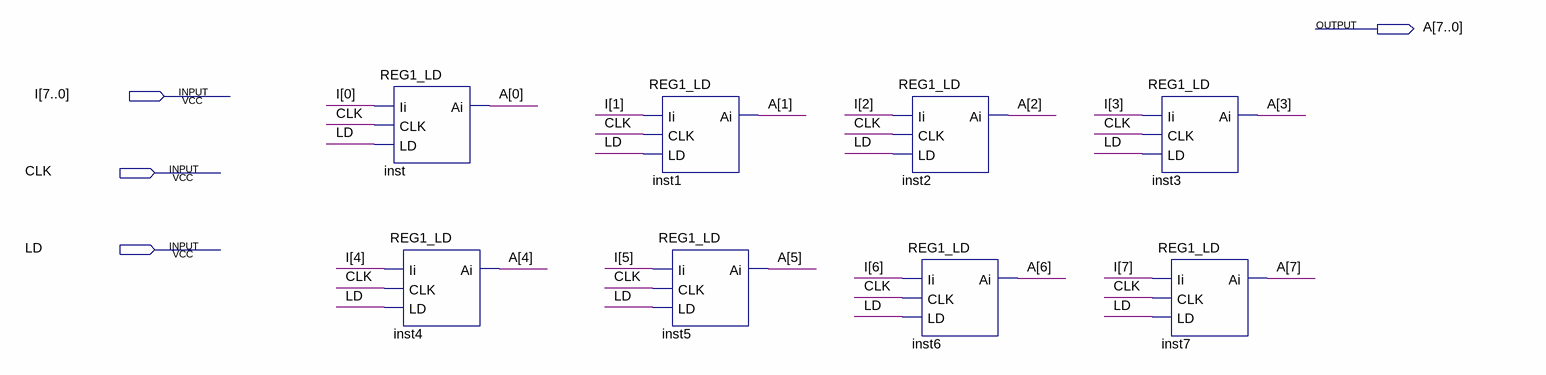
[diagram p0: schematic sheet]
// Quartus schematic REG8_LD.bdf as structural Verilog: 8 symbols, 4 pins
module REG8_LD (
  input  [7:0] I,
  input  CLK,
  input  LD,
  output [7:0] A
);

  REG1_LD inst (.Ii(I[0]), .CLK(CLK), .LD(LD), .Ai(A[0]));
  REG1_LD inst4 (.Ii(I[4]), .CLK(CLK), .LD(LD), .Ai(A[4]));
  REG1_LD inst1 (.Ii(I[1]), .CLK(CLK), .LD(LD), .Ai(A[1]));
  REG1_LD inst5 (.Ii(I[5]), .CLK(CLK), .LD(LD), .Ai(A[5]));
  REG1_LD inst2 (.Ii(I[2]), .CLK(CLK), .LD(LD), .Ai(A[2]));
  REG1_LD inst6 (.Ii(I[6]), .CLK(CLK), .LD(LD), .Ai(A[6]));
  REG1_LD inst3 (.Ii(I[3]), .CLK(CLK), .LD(LD), .Ai(A[3]));
  REG1_LD inst7 (.Ii(I[7]), .CLK(CLK), .LD(LD), .Ai(A[7]));
endmodule
